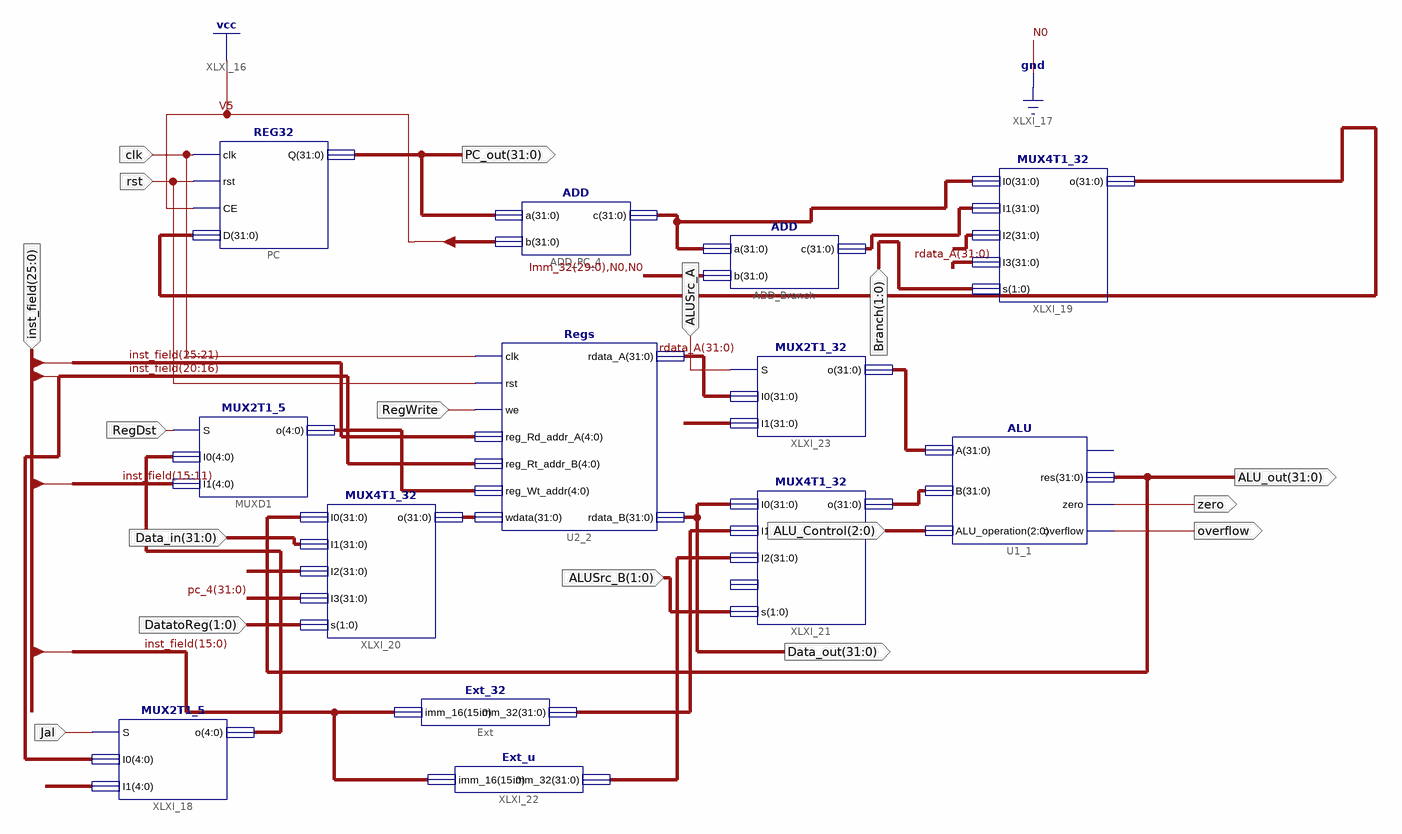
[diagram p0: schematic sheet 1]
// Xilinx ISE schematic Data_path.sch (kintex7) as structural Verilog: 13 symbols, 17 ports
module Data_path (
  input  clk,
  input  rst,
  input  [2:0] ALU_Control,
  input  [25:0] inst_field,
  input  RegDst,
  input  RegWrite,
  input  [1:0] ALUSrc_B,
  input  Jal,
  input  [1:0] Branch,
  input  [31:0] Data_in,
  input  [1:0] DatatoReg,
  input  ALUSrc_A,
  output [31:0] Data_out,
  output zero,
  output [31:0] PC_out,
  output overflow,
  output [31:0] ALU_out
);

  wire [4:0] XLXN_1, XLXN_27;
  wire [31:0] Imm_32, pc_4, rdata_A, XLXN_2, XLXN_4, XLXN_16, XLXN_37, XLXN_42, XLXN_58;

  REG32 PC (.clk(clk), .rst(rst), .CE(1'b1), .D(XLXN_37), .Q(PC_out));
  Regs U2_2 (
    .clk(clk), .rst(rst), .we(RegWrite), .reg_Rd_addr_A(inst_field[25:21]),
    .reg_Rt_addr_B(inst_field[20:16]), .reg_Wt_addr(XLXN_1), .wdata(XLXN_2), .rdata_A(rdata_A),
    .rdata_B(Data_out));
  MUX2T1_5 MUXD1 (.S(RegDst), .I0(XLXN_27), .I1(inst_field[15:11]), .o(XLXN_1));
  ALU U1_1 (
    .A(XLXN_58), .B(XLXN_4), .ALU_operation(ALU_Control), .res(ALU_out), .zero(zero), .overflow(overflow));  // open: Co
  ADD ADD_PC_4 (.a(PC_out), .b(32'b00000000000000000000000000000100), .c(pc_4));
  ADD ADD_Branch (.a(pc_4), .b({Imm_32[29:0], 2'b00}), .c(XLXN_16));
  Ext_32 Ext (.imm_16(inst_field[15:0]), .imm_32(Imm_32));
  MUX2T1_5 XLXI_18 (.S(Jal), .I0(inst_field[20:16]), .I1({5{1'b1}}), .o(XLXN_27));
  MUX4T1_32 XLXI_19 (
    .I0(pc_4), .I1(XLXN_16), .I2({pc_4[31:28], inst_field, 2'b00}), .I3(rdata_A), .s(Branch), .o(XLXN_37));
  MUX4T1_32 XLXI_20 (
    .I0(ALU_out), .I1(Data_in), .I2({inst_field[15:0], {16{1'b0}}}), .I3(pc_4), .s(DatatoReg), .o(XLXN_2));
  MUX4T1_32 XLXI_21 (.I0(Data_out), .I1(Imm_32), .I2(XLXN_42), .s(ALUSrc_B), .o(XLXN_4));  // open: I3
  Ext_u XLXI_22 (.imm_16(inst_field[15:0]), .imm_32(XLXN_42));
  MUX2T1_32 XLXI_23 (.S(ALUSrc_A), .I0(rdata_A), .I1({{27{1'b0}}, inst_field[10:6]}), .o(XLXN_58));
endmodule
